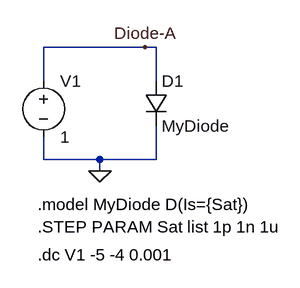
[diagram p0: schematic Fig_2-122-R_Diode_Test_MyDiode-2sat-sweep.asc]
Fig_2-122-R_Diode_Test_MyDiode-2sat-sweep.asc, the LTspice schematic file:
Version 4
SHEET 1 980 680
WIRE 272 80 128 80
WIRE 288 80 272 80
WIRE 128 128 128 80
WIRE 288 128 288 80
WIRE 128 240 128 208
WIRE 208 240 128 240
WIRE 288 240 288 192
WIRE 288 240 208 240
WIRE 208 256 208 240
FLAG 208 256 0
FLAG 272 80 Diode-A
SYMBOL diode 272 128 R0
SYMATTR InstName D1
SYMATTR Value MyDiode
SYMBOL voltage 128 112 R0
SYMATTR InstName V1
SYMATTR Value 1
TEXT 120 376 Left 2 !.dc V1 -5 -4 0.001
TEXT 120 304 Left 2 !.model MyDiode D(Is={Sat})
TEXT 120 336 Left 2 !.STEP PARAM Sat list 1p 1n 1u

The netlist it stands for:
* Fig_2-122-R_Diode_Test_MyDiode-2sat-sweep.asc
D1 Diode-A 0 MyDiode
V1 Diode-A 0 1
.model D D
.lib standard.dio
.dc V1 -5 -4 0.001
.model MyDiode D(Is={Sat})
.STEP PARAM Sat list 1p 1n 1u
.backanno
.end